# EAGLE design Smart Driver Adapter Caps (EAGLE 9.6.2)
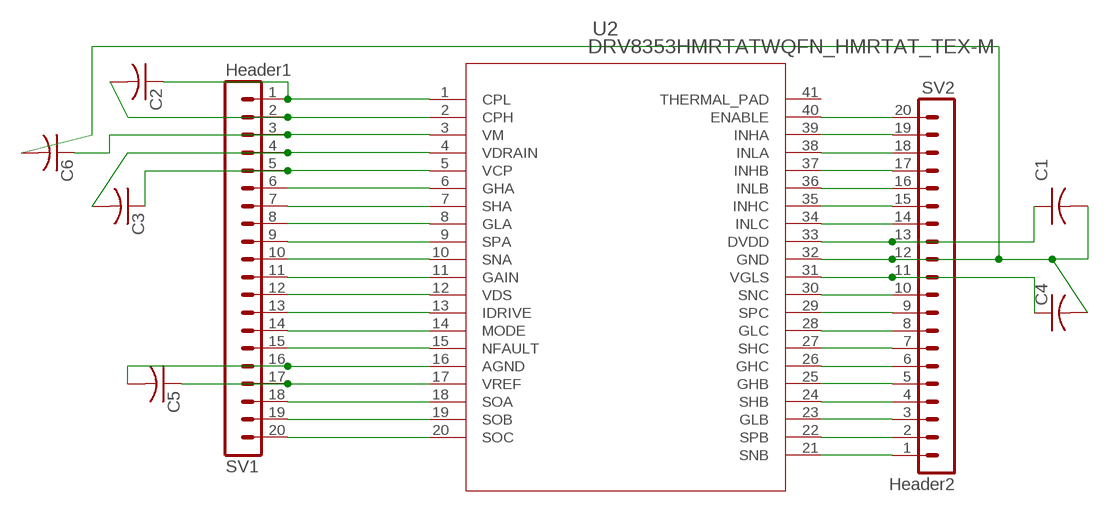
[diagram p0: schematic, sheet 1]

## Parts
C1  C-USC0603K  [C0603K]
C2  C-USC1206K  [C1206K]
C3  C-USC0805K  [C0805K]
C4  C-USC0805K  [C0805K]
C5  C-USC0201  [C0201]
C6  C-USC1206K  [C1206K]
SV1  Header1  MA20-1  [MA20-1]
SV2  Header2  MA20-1  [MA20-1]
U2  DRV8353HMRTATWQFN_HMRTAT_TEX-M  [WQFN_HMRTAT_TEX-M]

## Nets
N$1: C1.1 SV2.13 U2.33(DVDD)
N$2: SV1.14 U2.14(MODE)
N$3: C2.2 SV1.2 U2.2(CPH)
N$4: C6.1 SV1.3 U2.3(VM)
N$5: C3.1 SV1.5 U2.5(VCP)
N$7: SV1.6 U2.6(GHA)
N$8: SV1.7 U2.7(SHA)
N$9: SV1.8 U2.8(GLA)
N$10: SV1.9 U2.9(SPA)
N$11: SV1.10 U2.10(SNA)
N$12: SV1.11 U2.11(GAIN)
N$13: SV1.13 U2.13(IDRIVE)
N$14: SV1.15 U2.15(NFAULT)
N$15: C5.1 SV1.17 U2.17(VREF)
N$16: C4.1 SV2.11 U2.31(VGLS)
N$17: SV1.18 U2.18(SOA)
N$18: SV1.20 U2.20(SOC)
N$19: SV2.20 U2.40(ENABLE)
N$20: SV2.19 U2.39(INHA)
N$21: SV2.18 U2.38(INLA)
N$22: SV2.17 U2.37(INHB)
N$23: SV2.16 U2.36(INLB)
N$24: SV2.15 U2.35(INHC)
N$25: SV2.14 U2.34(INLC)
N$26: C5.2 SV1.16 U2.16(AGND)
N$27: C1.2 C4.2 C6.2 SV2.12 U2.32(GND)
N$28: C2.1 SV1.1 U2.1(CPL)
N$29: SV2.10 U2.30(SNC)
N$30: SV2.9 U2.29(SPC)
N$31: SV2.8 U2.28(GLC)
N$32: SV2.7 U2.27(SHC)
N$33: SV2.6 U2.26(GHC)
N$34: SV2.5 U2.25(GHB)
N$35: SV2.4 U2.24(SHB)
N$36: SV2.3 U2.23(GLB)
N$37: SV2.2 U2.22(SPB)
N$38: SV2.1 U2.21(SNB)
N$39: SV1.12 U2.12(VDS)
N$40: SV1.19 U2.19(SOB)
N$41: C3.2 SV1.4 U2.4(VDRAIN)
Unconnected: U2.41(THERMAL_PAD)

## Library data of the parts
C1-C6 = rcl:C-US: CAPACITOR, American symbol; SPICEPREFIX: C
SV1 SV2 = Modified_Header:MA20-1: PIN HEADER; OC_FARNELL: unknown; OC_NEWARK: unknown
U2 = DRV8353SMRTAT_ModPad:DRV8353HMRTAT; COPYRIGHT: Copyright (C) 2021 Ultra Librarian. All rights reserved.; DIGI-KEY_PART_NUMBER_1: 296-DRV8353HMRTATTR-ND; DIGI-KEY_PART_NUMBER_2: 296-DRV8353HMRTATCT-ND; DIGI-KEY_PART_NUMBER_3: 296-DRV8353HMRTATDKR-ND; MANUFACTURER_PART_NUMBER: DRV8353HMRTAT; MFR_NAME: Texas Instruments

## Board
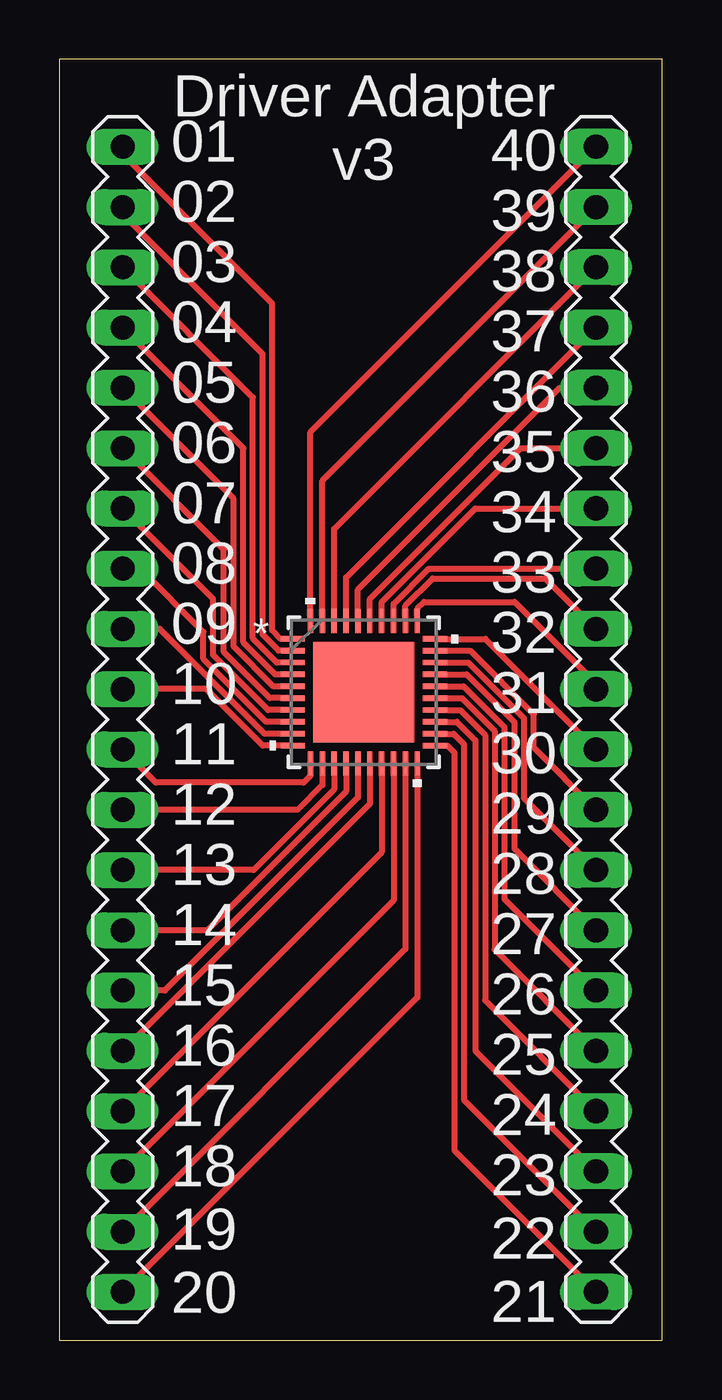
[diagram p1: board, top side]
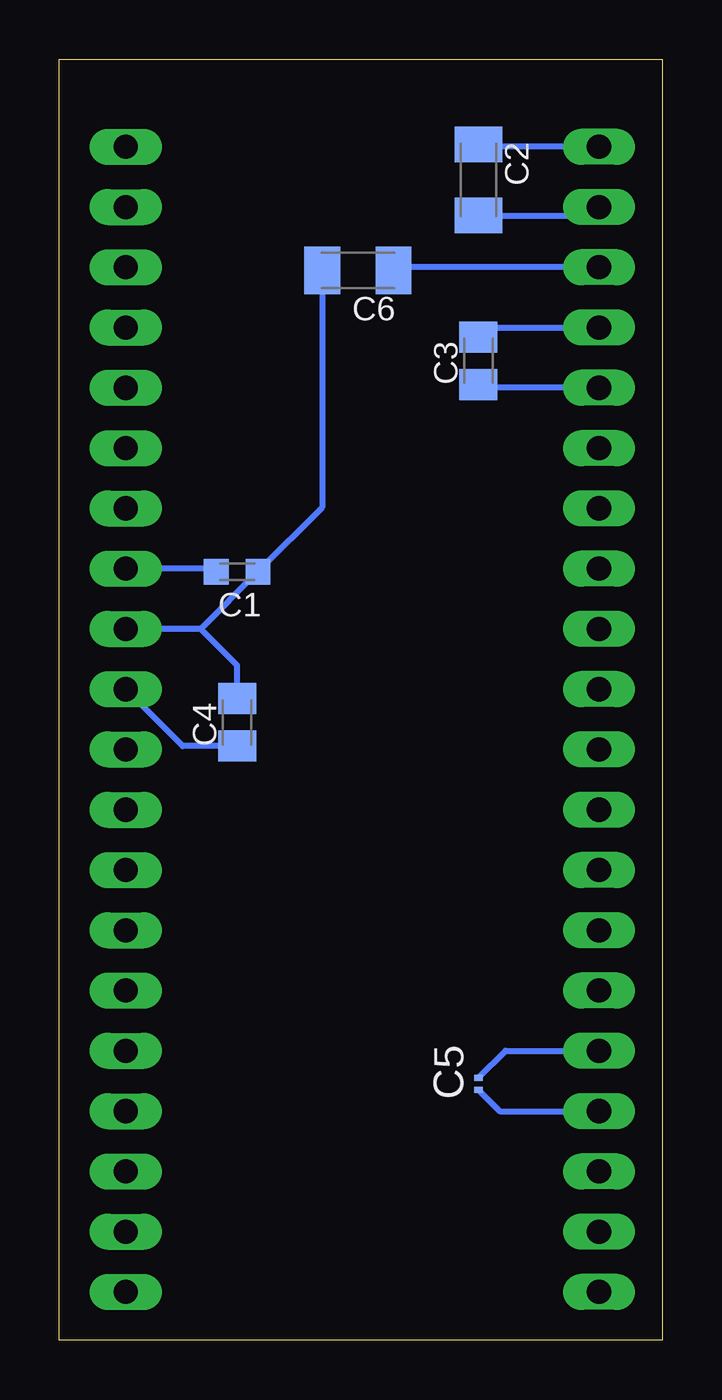
[diagram p2: board, bottom side, seen from below]

Size 25.4 x 53.98 mm. Coordinates in mm from the lower left corner, seen from the top.
Outline: 0,0 25.4,0 25.4,53.98 0,53.98 0,0
Copper layers (1*16): Top 0.035mm / dielectric 1.5mm / Bottom 0.035mm
Design rules "default": minimum track width 6mil, minimum drill 0.35mm, track to track 6mil, track to pad 6mil, pad to pad 6mil, via to via 6mil, smd to smd 6mil, copper to edge 40mil, drill to drill 6mil, minimum pad ring 10mil, minimum via ring 8mil, stop-mask expansion 4mil, vias tented up to drill 0mil, thermal gap 10mil

### Footprints (pad centres in the part's own frame; a part is rotated, then mirrored left to right if it is on the bottom)
C0603K = smd 1.05 x 1.08: 1 -0.875,0; 2 0.875,0
C1206K = smd 1.5 x 2: 1 -1.5,0; 2 1.5,0
C0805K = smd 1.3 x 1.6: 1 -1,0; 2 1,0
C0201 = smd 0.25 x 0.35: 1 -0.25,0; 2 0.25,0
MA20-1 = drill 1.016 long: 1 -24.13,0; 2 -21.59,0; 3 -19.05,0; 4 -16.51,0; 5 -13.97,0; 6 -11.43,0; 7 -8.89,0; 8 -6.35,0; 9 -3.81,0; 10 -1.27,0; 11 1.27,0; 12 3.81,0; 13 6.35,0; 14 8.89,0; 15 11.43,0; 16 13.97,0; 17 16.51,0; 18 19.05,0; 19 21.59,0; 20 24.13,0
WQFN_HMRTAT_TEX-M = smd 1.016 x 0.229: 1 -2.997,2.251; 2 -2.997,1.75; 3 -2.997,1.25; 4 -2.997,0.75; 5 -2.997,0.25; 6 -2.997,-0.25; 7 -2.997,-0.75; 8 -2.997,-1.25; 9 -2.997,-1.75; 10 -2.997,-2.251; 21 2.997,-2.251; 22 2.997,-1.75; 23 2.997,-1.25; 24 2.997,-0.75; 25 2.997,-0.25; 26 2.997,0.25; 27 2.997,0.75; 28 2.997,1.25; 29 2.997,1.75; 30 2.997,2.251 | smd 0.229 x 1.016: 11 -2.251,-2.997; 12 -1.75,-2.997; 13 -1.25,-2.997; 14 -0.75,-2.997; 15 -0.25,-2.997; 16 0.25,-2.997; 17 0.75,-2.997; 18 1.25,-2.997; 19 1.75,-2.997; 20 2.251,-2.997; 31 2.251,2.997; 32 1.75,2.997; 33 1.25,2.997; 34 0.75,2.997; 35 0.25,2.997; 36 -0.25,2.997; 37 -0.75,2.997; 38 -1.25,2.997; 39 -1.75,2.997; 40 -2.251,2.997 | smd 4.242 x 4.242: 41 0,0

### Placement (x,y rotation side)
C1  17.91,32.38 0 bottom
C2  7.75,48.89 270 bottom
C3  7.75,41.27 90 bottom
C4  17.91,26.04 90 bottom
C5  7.75,10.79 90 bottom
C6  12.83,45.09 180 bottom
SV1  2.67,26.16 270 top
SV2  22.61,26.16 90 top
U2  12.83,27.3 0 top

### Tracks (layer width: path | path; a pad name or v marks a point on that pad's centre or on a via)
N$1
  Top 0.254: U2.33 14.08,31.03 15.56,32.51 SV2.13
  Bottom 0.254: C1.1 18.91,32.51 SV2.13
N$2
  Top 0.254: SV1.14 6.22,17.27 12.08,23.13 U2.14
N$3
  Top 0.254: U2.2 9.24,29.05 8.56,29.74 8.56,41.55 2.67,47.45 SV1.2
  Bottom 0.254: C2.2 3.02,47.39 SV1.2
N$4
  Top 0.254: U2.3 9.17,28.55 8.15,29.57 8.15,39.73 SV1.3
  Bottom 0.254: SV1.3 11.2,45.21 C6.1
N$5
  Top 0.254: U2.5 9.02,27.55 7.34,29.23 7.34,35.46 SV1.5
  Bottom 0.254: SV1.5 7.6,40.13 C3.1
N$7
  Top 0.254: SV1.6 6.93,33.32 6.93,28.99 8.87,27.05 U2.6
N$8
  Top 0.254: SV1.7 6.48,31.24 6.48,28.88 8.8,26.55 U2.7
N$9
  Top 0.254: SV1.8 3.4,32.51 6.07,29.84 6.07,28.71 8.72,26.05 U2.8
N$10
  Top 0.254: SV1.9 4.23,29.97 8.65,25.55 U2.9
N$11
  Top 0.254: SV1.10 6.2,27.43 8.57,25.05 U2.10
N$12
  Top 0.254: SV1.11 4.06,23.49 10.29,23.49 10.58,23.78 U2.11
N$13
  Top 0.254: SV1.13 8.19,19.81 11.58,23.2 U2.13
N$14
  Top 0.254: SV1.15 4.44,14.73 12.58,22.86 U2.15
N$15
  Top 0.254: U2.17 13.58,20.56 SV1.17
  Bottom 0.254: C5.1 6.85,9.65 SV1.17
N$16
  Top 0.254: U2.31 15.08,30.83 15.37,31.12 19.18,31.12 22.61,27.69 SV2.11
  Bottom 0.254: C4.1 20.21,25.04 SV2.11
N$17
  Top 0.254: SV1.18 14.08,18.52 U2.18
N$18
  Top 0.254: SV1.20 15.08,14.44 U2.20
N$19
  Top 0.254: SV2.20 10.58,38.26 U2.40
N$20
  Top 0.254: SV2.19 11.08,36.22 U2.39
N$21
  Top 0.254: SV2.18 11.58,34.18 U2.38
N$22
  Top 0.254: SV2.17 12.08,32.14 U2.37
N$23
  Top 0.254: SV2.16 21.08,40.13 12.58,31.63 U2.36
N$24
  Top 0.254: SV2.15 19.43,37.59 13.08,31.24 U2.35
N$25
  Top 0.254: SV2.14 17.53,35.05 13.58,31.1 U2.34
N$26
  Top 0.254: U2.16 13.08,22.6 SV1.16
  Bottom 0.254: C5.2 6.6,12.19 SV1.16
N$27
  Top 0.254: U2.32 14.58,30.95 15.73,32.11 20.47,32.11 SV2.12
  Bottom 0.254: C6.2 14.33,35.09 C1.2 19.45,29.97 | 19.45,29.97 SV2.12 | C4.2 17.91,28.43 19.45,29.97
N$28
  Top 0.254: U2.1 9.32,29.56 8.97,29.9 8.97,43.69 2.67,49.99 SV1.1
  Bottom 0.254: SV1.1 7.64,50.29 C2.1
N$29
  Top 0.254: SV2.10 17.94,29.56 U2.30
N$30
  Top 0.254: SV2.9 19.99,24.97 19.99,26.37 17.31,29.05 U2.29
N$31
  Top 0.254: SV2.8 19.58,22.83 19.58,26.2 17.23,28.55 U2.28
N$32
  Top 0.254: SV2.7 19.18,20.7 19.18,26.04 17.16,28.05 U2.27
N$33
  Top 0.254: SV2.6 18.75,18.59 18.75,25.84 17.03,27.55 U2.26
N$34
  Top 0.254: SV2.5 18.34,16.46 18.34,25.67 16.95,27.05 U2.25
N$35
  Top 0.254: SV2.4 17.93,14.33 17.93,25.5 16.88,26.55 U2.24
N$36
  Top 0.254: SV2.3 17.53,12.19 17.53,25.27 16.74,26.05 U2.23
N$37
  Top 0.254: SV2.2 17.04,10.13 17.04,25.12 16.61,25.55 U2.22
N$38
  Top 0.254: SV2.1 16.64,8 16.64,24.77 16.35,25.05 U2.21
N$39
  Top 0.254: SV1.12 10.03,22.35 11.08,23.4 U2.12
N$40
  Top 0.254: SV1.19 14.58,16.48 U2.19
N$41
  Top 0.254: U2.4 9.09,28.05 7.75,29.4 7.75,37.59 SV1.4
  Bottom 0.254: C3.2 7.35,42.67 SV1.4

### Text on the board
tPlace: 01 | Driver Adapter / v3 | 40 | 02 | 39 | 03 | 38 | 04 | 37 | 05 | 36 | 06 | 35 | 07 | 34 | 08 | 33 | 09 | 32 | 10 | 31 | 11 | 30 | 12 | 29 | 13 | 28 | 14 | 27 | 15 | 26 | 16 | 25 | 17 | 24 | 18 | 23 | 19 | 22 | 20 | 21